# Altium schematic sheet Cover Sheet.SchDoc
size B; Organization: Altium Limited; Address1: L3, 12a Rodborough Rd; Address2: Frenchs Forest; Address3: NSW; Address4: Australia 2086; SheetNumber: 1; SheetTotal: 1
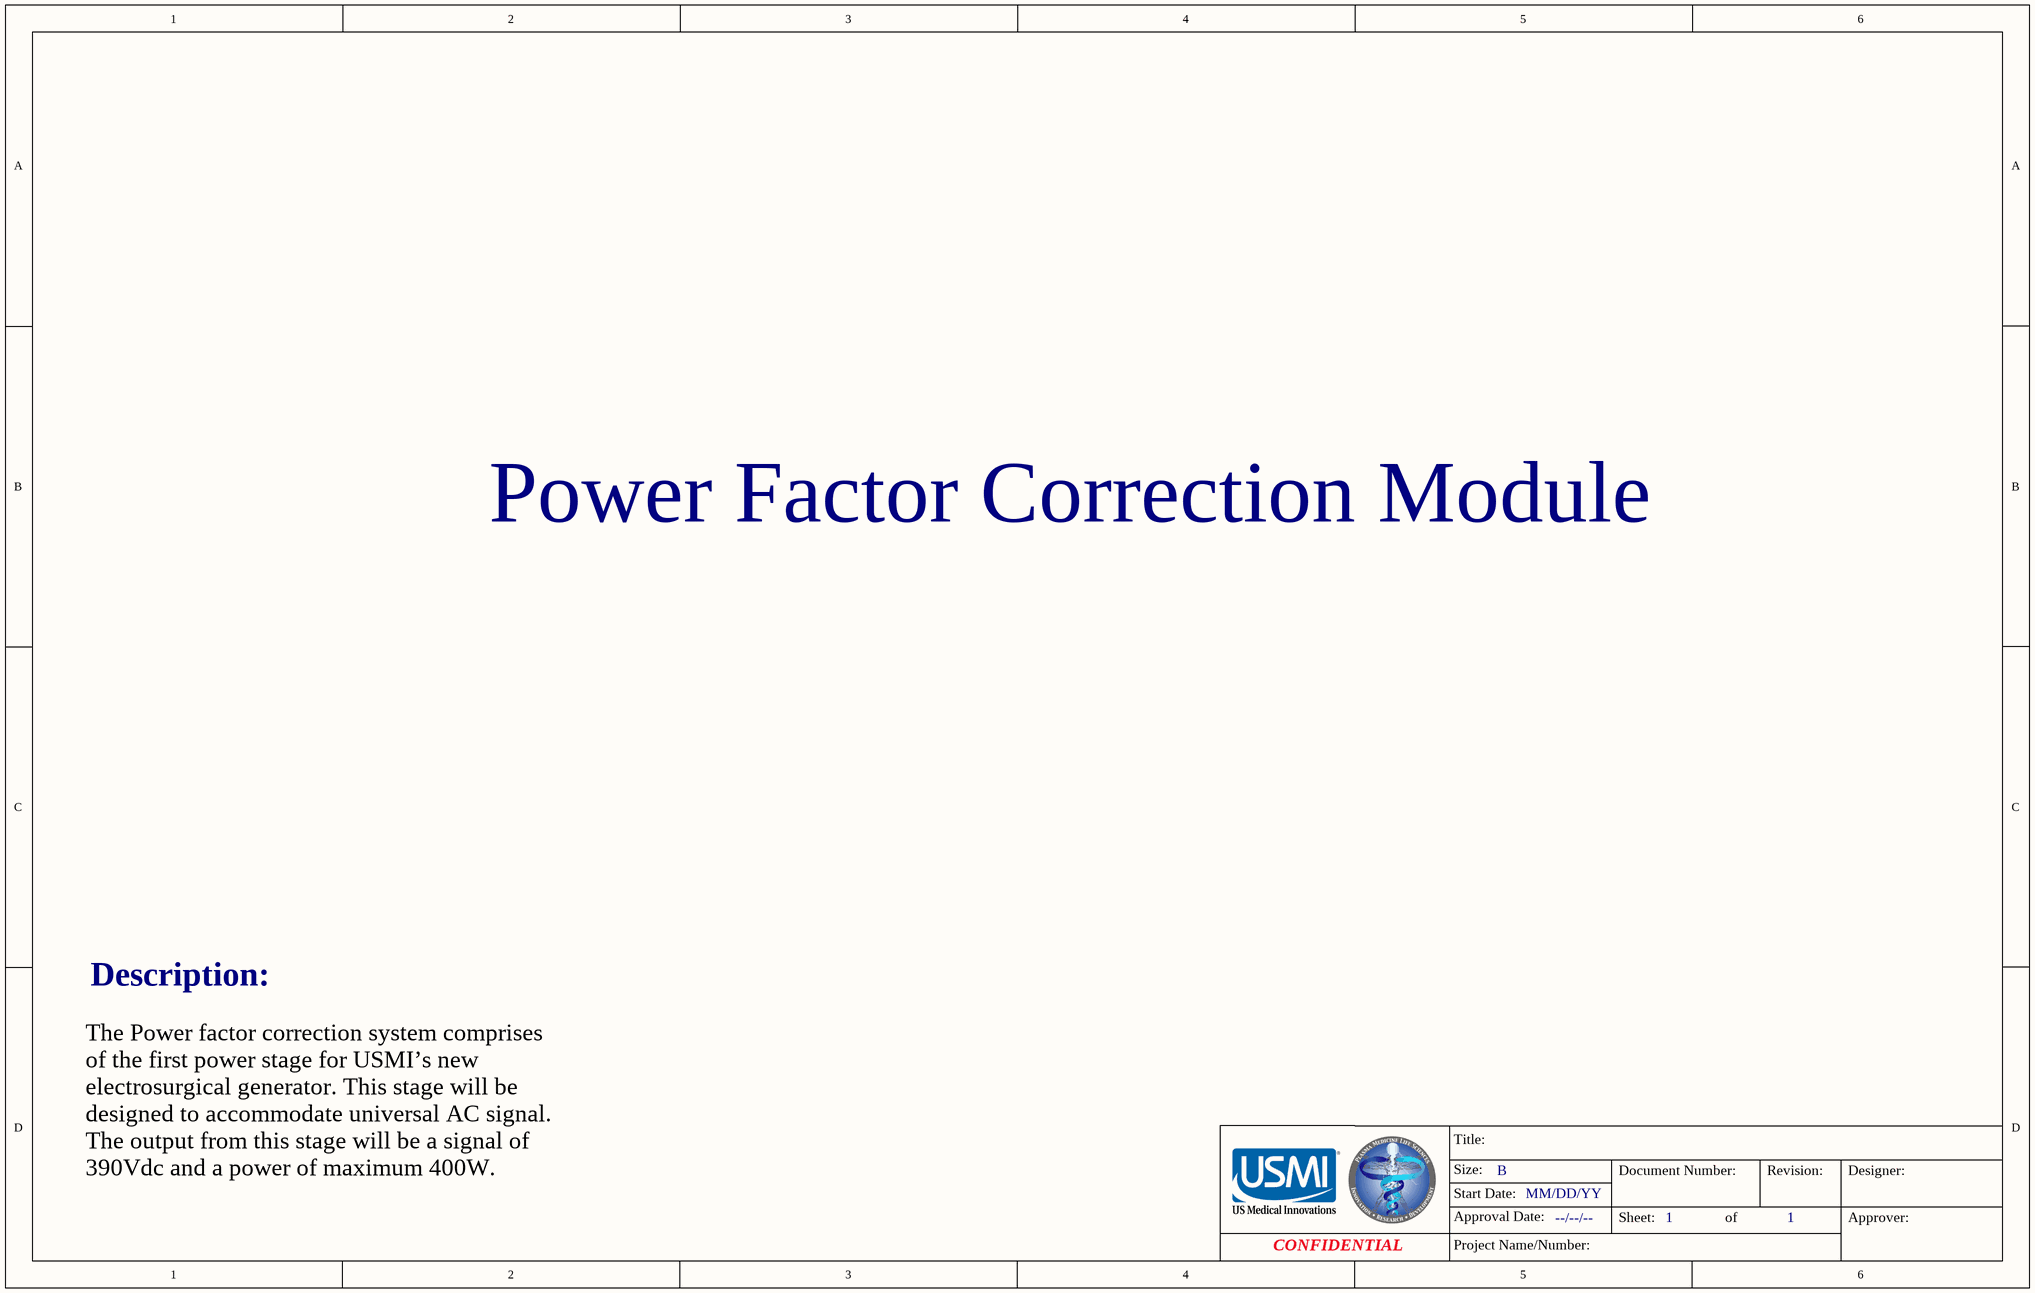
[diagram p0: Cover Sheet.SchDoc]

## Notes on the sheet
- Power Factor Correction Module
- Description:
- The Power factor correction system comprises of the first power stage for USMI’s new electrosurgical generator. This stage will be designed to accommodate universal AC signal. The output from this stage will be a signal of 390Vdc and a power of maximum 400W.
- Title:
- Size:
- B
- Document Number:
- Revision:
- Designer:
- Approval Date:
- Start Date:
- MM/DD/YY
- --/--/--
- Sheet:
- of
- Approver:
- CONFIDENTIAL
- Project Name/Number: